# Altium schematic sheet 3_axis_sheld.SchDoc: 3 Axis Sheld
size A4; CompanyName: James Cook University; Organization: James Cook University; DocumentNumber: 2; Revision: 2; SheetNumber: 1; SheetTotal: 5; ProjectName: *ProjectName
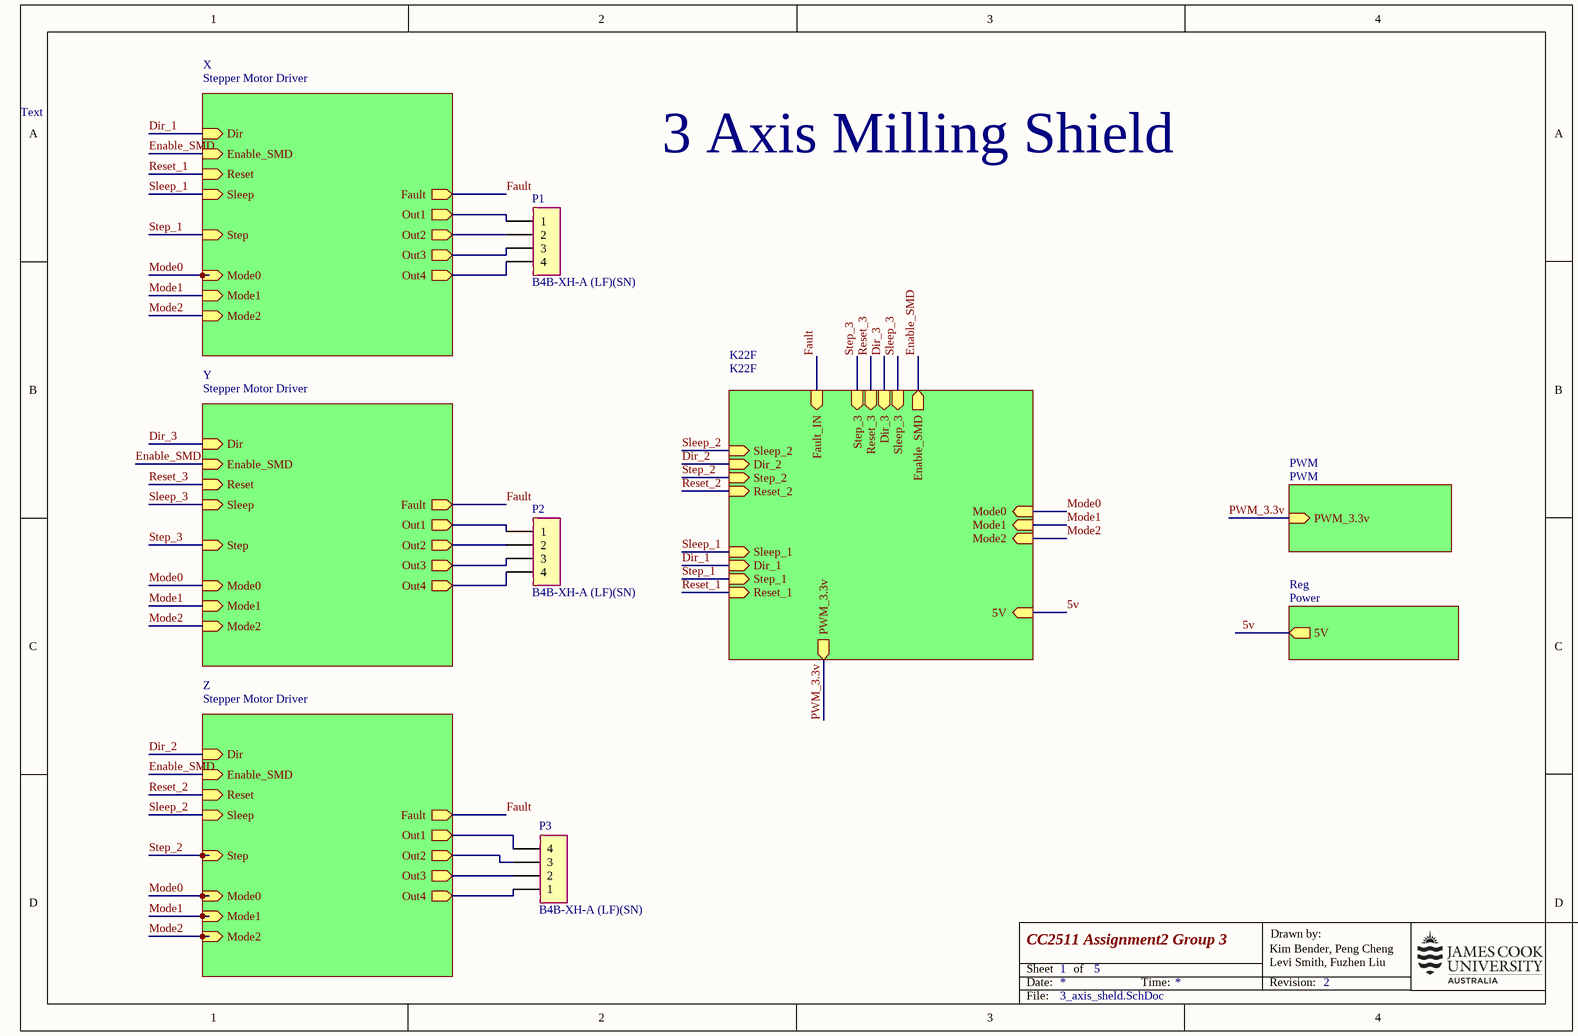
[diagram p0: 3_axis_sheld.SchDoc]

## Parts
P1  B4B-XH-A (LF)(SN)  [B4B-XH-A (LF)(SN)]
P2  B4B-XH-A (LF)(SN)  [B4B-XH-A (LF)(SN)]
P3  B4B-XH-A (LF)(SN)  [B4B-XH-A (LF)(SN)]

## Sub-sheets
K22F = K22F: Step_2 (in), Reset_2 (in), Step_1 (in), Dir_1 (in), Reset_1 (in), Sleep_1 (in), Dir_2 (in), Sleep_2 (in), Step_3 (in), Reset_3 (in), Dir_3 (in), Sleep_3 (in), Mode2 (in), Mode1 (in), Mode0 (in), PWM_3.3v (out), Fault_IN (in), Enable_SMD (out), 5V (in)
PWM = PWM: PWM_3.3v (in)
Reg = Power: 5V (out)
X = Stepper Motor Driver: Dir (in), Reset (in), Sleep (in), Mode0 (in), Step (in), Mode2 (in), Mode1 (in), Out2 (out), Fault (out), Out1 (out), Out3 (out), Out4 (out), Enable_SMD (in)
Y = Stepper Motor Driver: Dir (in), Reset (in), Sleep (in), Mode0 (in), Step (in), Mode2 (in), Mode1 (in), Out2 (out), Fault (out), Out1 (out), Out3 (out), Out4 (out), Enable_SMD (in)
Z = Stepper Motor Driver: Dir (in), Reset (in), Sleep (in), Mode0 (in), Step (in), Mode2 (in), Mode1 (in), Out2 (out), Fault (out), Out1 (out), Out3 (out), Out4 (out), Enable_SMD (in)

## Nets
5v: sheet K22F/5V, sheet Reg/5V
Dir_1: sheet X/Dir, sheet K22F/Dir_1
Dir_2: sheet Z/Dir, sheet K22F/Dir_2
Dir_3: sheet Y/Dir, sheet K22F/Dir_3
Enable_SMD: sheet X/Enable_SMD, sheet Z/Enable_SMD, sheet Y/Enable_SMD, sheet K22F/Enable_SMD
Fault: sheet X/Fault, sheet Z/Fault, sheet Y/Fault, sheet K22F/Fault_IN
Mode0: sheet X/Mode0, sheet Z/Mode0, sheet Y/Mode0, sheet K22F/Mode0
Mode1: sheet X/Mode1, sheet Z/Mode1, sheet Y/Mode1, sheet K22F/Mode1
Mode2: sheet X/Mode2, sheet Z/Mode2, sheet Y/Mode2, sheet K22F/Mode2
PWM_3.3v: sheet K22F/PWM_3.3v, sheet PWM/PWM_3.3v
Reset_1: sheet X/Reset, sheet K22F/Reset_1
Reset_2: sheet Z/Reset, sheet K22F/Reset_2
Reset_3: sheet Y/Reset, sheet K22F/Reset_3
Sleep_1: sheet X/Sleep, sheet K22F/Sleep_1
Sleep_2: sheet Z/Sleep, sheet K22F/Sleep_2
Sleep_3: sheet Y/Sleep, sheet K22F/Sleep_3
Step_1: sheet X/Step, sheet K22F/Step_1
Step_2: sheet Z/Step, sheet K22F/Step_2
Step_3: sheet Y/Step, sheet K22F/Step_3
NetP1_1: P1.1 ; sheet X/Out1
NetP1_2: P1.2 ; sheet X/Out2
NetP1_3: P1.3 ; sheet X/Out3
NetP1_4: P1.4 ; sheet X/Out4
NetP2_1: P2.1 ; sheet Y/Out1
NetP2_2: P2.2 ; sheet Y/Out2
NetP2_3: P2.3 ; sheet Y/Out3
NetP2_4: P2.4 ; sheet Y/Out4
NetP3_1: P3.1 ; sheet Z/Out4
NetP3_2: P3.2 ; sheet Z/Out3
NetP3_3: P3.3 ; sheet Z/Out2
NetP3_4: P3.4 ; sheet Z/Out1

## Notes on the sheet
- Text
- 3 Axis Milling Shield
- CC2511 Assignment2 Group 3
- Date:
- Sheet
- of
- Time:
- Revision:
- Kim Bender, Peng Cheng
- Levi Smith, Fuzhen Liu
- Drawn by:
- File:

## Library data of the parts
P1-P3 = B4B-XH-A (LF)(SN) Wire-to-board connector: Wire-to-board connector, vertical, 2.5mm, 4 contacts